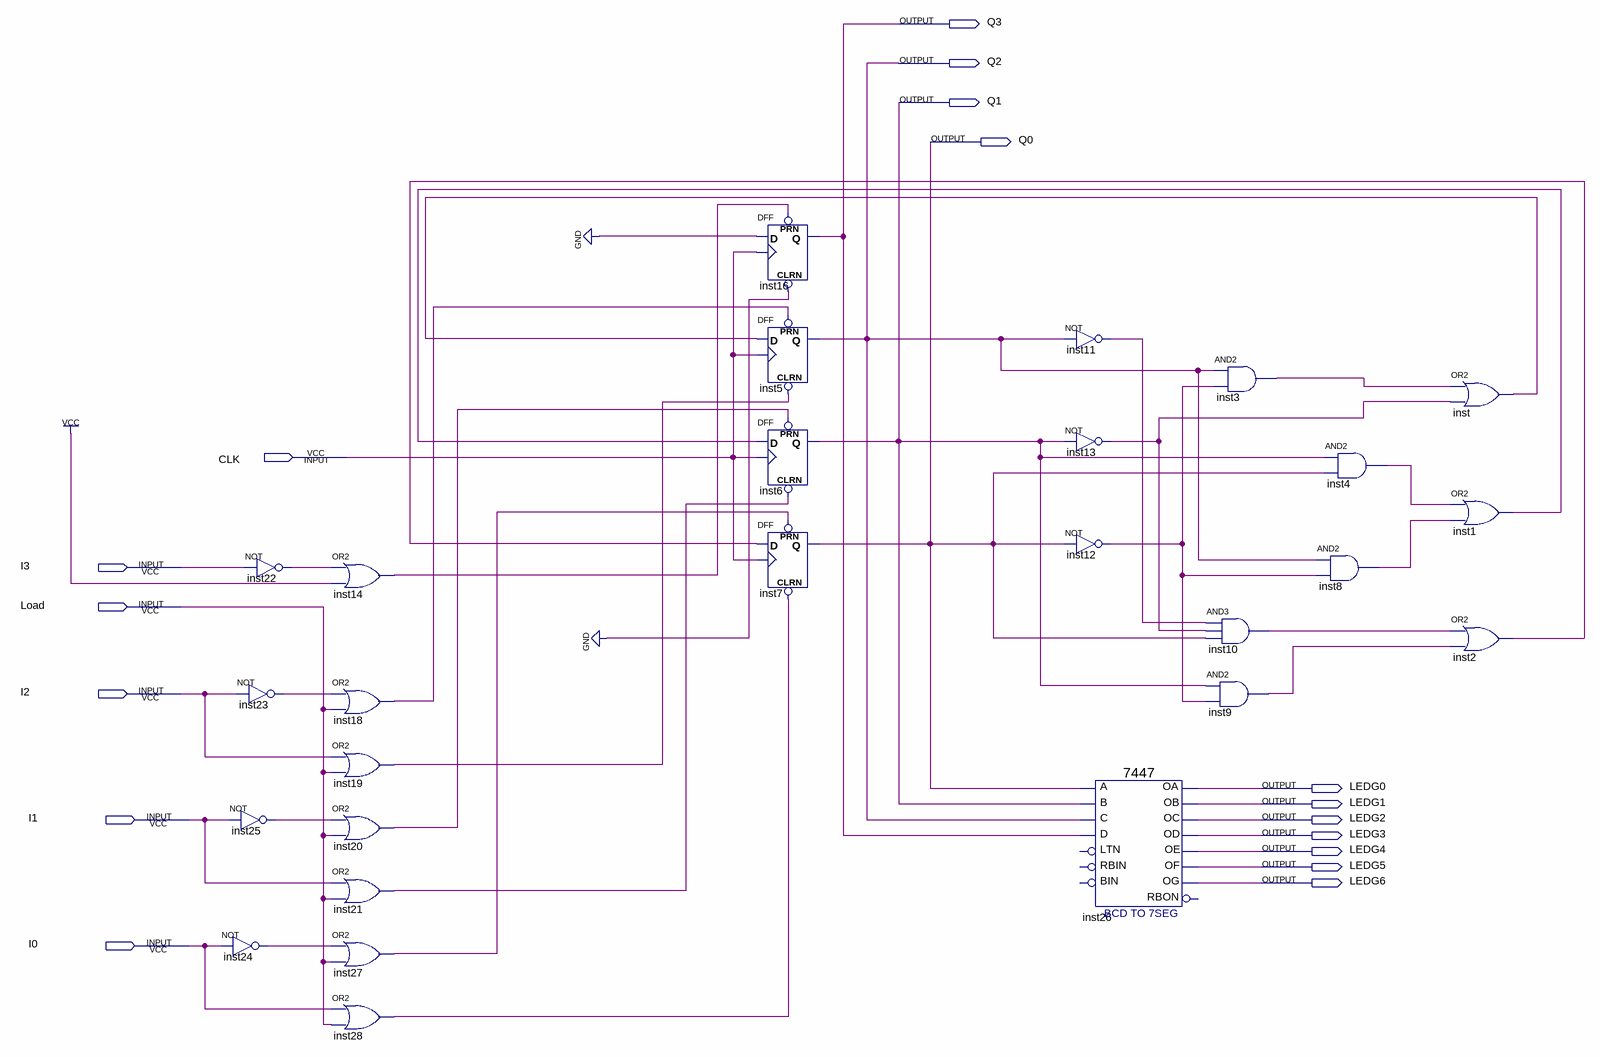
[diagram p0: schematic sheet]
// Quartus schematic Lab1_21522233.bdf as structural Verilog: 27 symbols, 17 pins
module Lab1_21522233 (
  input  CLK,
  input  I3,
  input  Load,
  input  I2,
  input  I1,
  input  I0,
  output Q3,
  output Q2,
  output Q1,
  output Q0,
  output LEDG0,
  output LEDG1,
  output LEDG2,
  output LEDG3,
  output LEDG4,
  output LEDG5,
  output LEDG6
);

  wire inst1_out, inst2_out, inst3_out, inst4_out, inst8_out, inst9_out, inst10_out, inst11_out, inst12_out,
       inst13_out, inst14_out, inst18_out, inst19_out, inst20_out, inst21_out, inst22_out, inst23_out,
       inst24_out, inst25_out, inst27_out, inst28_out, inst_out;

  not inst24 (inst24_out, I0);
  not inst22 (inst22_out, I3);
  not inst23 (inst23_out, I2);
  not inst25 (inst25_out, I1);
  or inst14 (inst14_out, inst22_out, 1'b1);
  or inst18 (inst18_out, inst23_out, Load);
  or inst19 (inst19_out, I2, Load);
  or inst20 (inst20_out, inst25_out, Load);
  or inst21 (inst21_out, I1, Load);
  or inst27 (inst27_out, inst24_out, Load);
  or inst28 (inst28_out, I0, Load);
  DFF inst16 (.CLRN(1'b0), .CLK(CLK), .D(1'b0), .PRN(inst14_out), .Q(Q3));
  DFF inst5 (.CLRN(inst19_out), .CLK(CLK), .D(inst_out), .PRN(inst18_out), .Q(Q2));
  DFF inst6 (.CLRN(inst21_out), .CLK(CLK), .D(inst1_out), .PRN(inst20_out), .Q(Q1));
  DFF inst7 (.CLRN(inst28_out), .CLK(CLK), .D(inst2_out), .PRN(inst27_out), .Q(Q0));
  not inst11 (inst11_out, Q2);
  not inst13 (inst13_out, Q1);
  not inst12 (inst12_out, Q0);
  \7447  inst26 (
    .B(Q1), .C(Q2), .D(Q3), .A(Q0), .OB(LEDG1), .OC(LEDG2), .OE(LEDG4), .OD(LEDG3), .OF(LEDG5), .OG(LEDG6),
    .OA(LEDG0));  // open: LTN, RBIN, BIN, RBON
  and inst3 (inst3_out, Q2, inst12_out);
  and inst10 (inst10_out, inst11_out, inst13_out, Q0);
  and inst9 (inst9_out, Q1, inst12_out);
  and inst4 (inst4_out, Q1, Q0);
  and inst8 (inst8_out, Q2, inst12_out);
  or inst (inst_out, inst3_out, inst13_out);
  or inst1 (inst1_out, inst4_out, inst8_out);
  or inst2 (inst2_out, inst10_out, inst9_out);
endmodule
